# Altium schematic sheet video.SchDoc
size A4
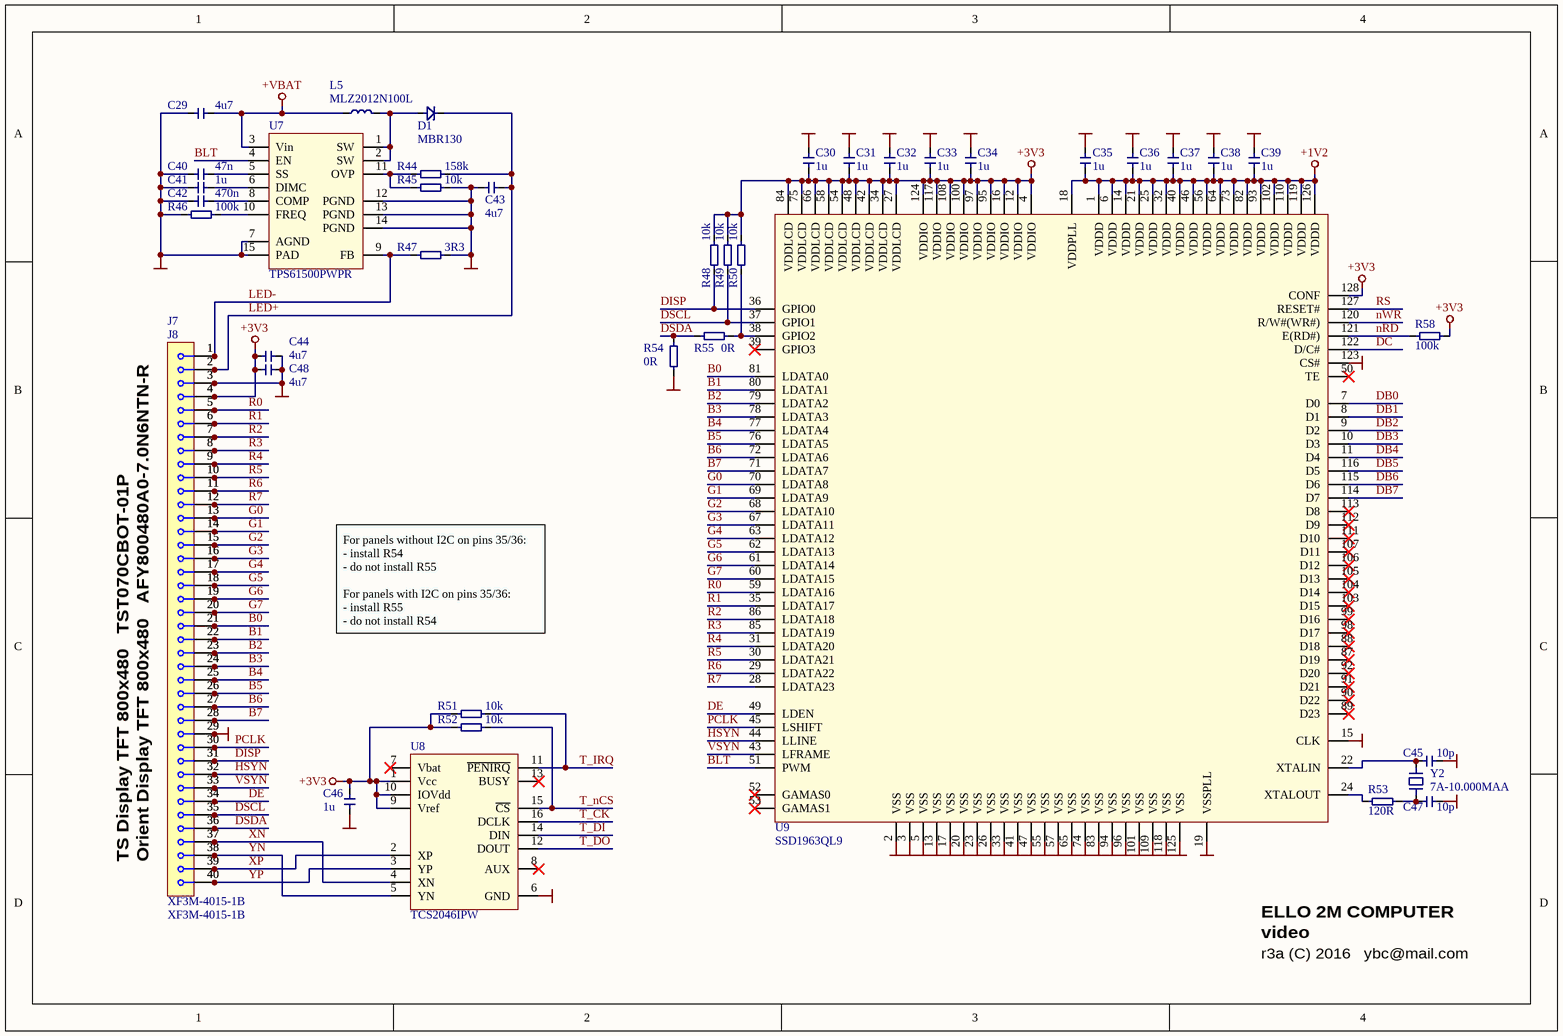
[diagram p0: video.SchDoc]

## Parts
C29  4u7  [_1206]
C30  1u  [_0603]
C31  1u  [_0603]
C32  1u  [_0603]
C33  1u  [_0603]
C34  1u  [_0603]
C35  1u  [_0603]
C36  1u  [_0603]
C37  1u  [_0603]
C38  1u  [_0603]
C39  1u  [_0603]
C40  47n  [_0603]
C41  1u  [_0603]
C42  470n  [_0603]
C43  4u7  [_1206]
C44  4u7  [_1206]
C45  10p  [_0603]
C46  1u  [_0603]
C47  10p  [_0603]
C48  4u7  [_1206]
D1  MBR130  [SOD-123]
J7  XF3M-4015-1B  [XF3M-4015-1B]
J8  XF3M-4015-1B  [XF3M-4015-1B]
L5  MLZ2012N100L  [_0805_IND]
R44  158k  [_0603]
R45  10k  [_0603]
R46  100k  [_0603]
R47  3R3  [_1206]
R48  10k  [_0603]
R49  10k  [_0603]
R50  10k  [_0603]
R51  10k  [_0603]
R52  10k  [_0603]
R53  120R  [_0603]
R54  0R  [_0603]
R55  0R  [_0603]
R58  100k  [_0603]
U7  TPS61500PWPR  [TSOP65P650X110_HS-14N]
U8  TCS2046IPW  [SOP65P640X120-16N]
U9  SSD1963QL9  [SQFP40P1600X1600-128N]
Y2  7A-10.000MAA  [Crystal 50x32 (2)]

## Nets
+1V2: C35.2 C36.2 C37.2 C38.2 C39.2 U9.1(VDDD) U9.6(VDDD) U9.14(VDDD) U9.18(VDDPLL) U9.21(VDDD) U9.25(VDDD) U9.32(VDDD) U9.40(VDDD) U9.46(VDDD) U9.56(VDDD) U9.64(VDDD) U9.73(VDDD) U9.82(VDDD) U9.93(VDDD) U9.102(VDDD) U9.110(VDDD) U9.119(VDDD) U9.126(VDDD)
+3V3: C30.2 C31.2 C32.2 C33.2 C34.2 C44.2 C46.1 C48.2 J7.4 J8.4 R48.2 R49.2 R50.2 R51.2 R52.2 R58.2 U8.1(Vcc) U8.9(Vref) U8.10(IOVdd) U9.4(VDDIO) U9.12(VDDIO) U9.16(VDDIO) U9.27(VDDLCD) U9.34(VDDLCD) U9.42(VDDLCD) U9.48(VDDLCD) U9.54(VDDLCD) U9.58(VDDLCD) U9.66(VDDLCD) U9.75(VDDLCD) U9.84(VDDLCD) U9.95(VDDIO) U9.97(VDDIO) U9.100(VDDIO) U9.108(VDDIO) U9.117(VDDIO) U9.124(VDDIO) U9.128(CONF)
+VBAT: C29.1 L5.1 U7.3(Vin)
GND: C29.2 C30.1 C31.1 C32.1 C33.1 C34.1 C35.1 C36.1 C37.1 C38.1 C39.1 C40.2 C41.2 C42.2 C43.1 C44.1 C45.2 C46.2 C47.2 C48.1 J7.3 J7.29 J8.3 J8.29 R45.2 R46.2 R47.1 R54.2 U7.7(AGND) U7.12(PGND) U7.13(PGND) U7.14(PGND) U7.15(PAD) U8.6(GND) U9.2(VSS) U9.3(VSS) U9.5(VSS) U9.13(VSS) U9.15(CLK) U9.17(VSS) U9.19(VSSPLL) U9.20(VSS) U9.23(VSS) U9.26(VSS) U9.33(VSS) U9.41(VSS) U9.47(VSS) U9.55(VSS) U9.57(VSS) U9.65(VSS) U9.74(VSS) U9.83(VSS) U9.94(VSS) U9.96(VSS) U9.101(VSS) U9.109(VSS) U9.118(VSS) U9.123(CS#) U9.125(VSS)
B0: J7.21 J8.21 U9.81(LDATA0)
B1: J7.22 J8.22 U9.80(LDATA1)
B2: J7.23 J8.23 U9.79(LDATA2)
B3: J7.24 J8.24 U9.78(LDATA3)
B4: J7.25 J8.25 U9.77(LDATA4)
B5: J7.26 J8.26 U9.76(LDATA5)
B6: J7.27 J8.27 U9.72(LDATA6)
B7: J7.28 J8.28 U9.71(LDATA7)
BLT: U7.4(EN) U9.51(PWM)
DB0: U9.7(D0)
DB1: U9.8(D1)
DB2: U9.9(D2)
DB3: U9.10(D3)
DB4: U9.11(D4)
DB5: U9.116(D5)
DB6: U9.115(D6)
DB7: U9.114(D7)
DC: U9.122(D/C#)
DE: J7.34 J8.34 U9.49(LDEN)
DISP: J7.31 J8.31 R48.1 U9.36(GPIO0)
DSCL: J7.35 J8.35 R49.1 U9.37(GPIO1)
DSDA: J7.36 J8.36 R54.1 R55.2
G0: J7.13 J8.13 U9.70(LDATA8)
G1: J7.14 J8.14 U9.69(LDATA9)
G2: J7.15 J8.15 U9.68(LDATA10)
G3: J7.16 J8.16 U9.67(LDATA11)
G4: J7.17 J8.17 U9.63(LDATA12)
G5: J7.18 J8.18 U9.62(LDATA13)
G6: J7.19 J8.19 U9.61(LDATA14)
G7: J7.20 J8.20 U9.60(LDATA15)
HSYN: J7.32 J8.32 U9.44(LLINE)
LED+: C43.2 D1.1 J7.2 J8.2 R44.2
LED-: J7.1 J8.1 R47.2 U7.9(FB)
nRD: R58.1 U9.121(E(RD#))
nWR: U9.120(R/W#(WR#))
PCLK: J7.30 J8.30 U9.45(LSHIFT)
R0: J7.5 J8.5 U9.59(LDATA16)
R1: J7.6 J8.6 U9.35(LDATA17)
R2: J7.7 J8.7 U9.86(LDATA18)
R3: J7.8 J8.8 U9.85(LDATA19)
R4: J7.9 J8.9 U9.31(LDATA20)
R5: J7.10 J8.10 U9.30(LDATA21)
R6: J7.11 J8.11 U9.29(LDATA22)
R7: J7.12 J8.12 U9.28(LDATA23)
RS: U9.127(RESET#)
T_CK: U8.16(DCLK)
T_DI: U8.14(DIN)
T_DO: U8.12(DOUT)
T_IRQ: R51.1 U8.11(~{PENIRQ})
T_nCS: R52.1 U8.15(~{CS})
VSYN: J7.33 J8.33 U9.43(LFRAME)
XN: J7.37 J8.37 U8.4(XN)
XP: J7.39 J8.39 U8.2(XP)
YN: J7.38 J8.38 U8.5(YN)
YP: J7.40 J8.40 U8.3(YP)
NetC40_1: C40.1 U7.5(SS)
NetC41_1: C41.1 U7.6(DIMC)
NetC42_1: C42.1 U7.8(COMP)
NetC45_1: C45.1 U9.22(XTALIN) Y2.2
NetC47_1: C47.1 R53.1 Y2.1
NetD1_2: D1.2 L5.2 U7.1(SW) U7.2(SW)
NetR44_1: R44.1 R45.1 U7.11(OVP)
NetR46_1: R46.1 U7.10(FREQ)
NetR50_1: R50.1 R55.1 U9.38(GPIO2)
NetR53_2: R53.2 U9.24(XTALOUT)

Not connected (* = marked no-connect by the designer): U8 7(Vbat)* 8(AUX)* 13(BUSY)*; U9 39(GPIO3)* 50(TE)* 52(GAMAS0)* 53(GAMAS1)* 87(D19)* 88(D18)* 89(D23)* 90(D22)* 91(D21)* 92(D20)* 98(D17)* 99(D16)* 103(D15)* 104(D14)* 105(D13)* 106(D12)* 107(D11)* 111(D10)* 112(D9)* 113(D8)*

## Notes on the sheet
- For panels without I2C on pins 35/36:
  - install R54
  - do not install R55
  For panels with I2C on pins 35/36:
  - install R55
  - do not install R54
- TS Display TFT 800x480   TST070CBOT-01P
- Orient Display TFT 800x480   AFY800480A0-7.0N6NTN-R
- ELLO 2M COMPUTER
- r3a (C) 2016   ybc@mail.com
- video

## Library data of the parts
C29-C48 = Capacitor
D1 = Diode Schottky: Schottky diode
J7 J8 = Connector 1x40: Single row, 40-way connector
L5 = Inductor
R44-R55 R58 = Resistor
U7 = TPS61500: TPS61500 3-A Boost Converter for High Brightness  LED Driver With Multiple Dimming Methods; Manufacturer: Texas Instruments
U8 = XPT2046 (TSOP16): Manufacturer: Shenzhen XPTEK Technology; URL: http://www.xptek.com.cn; Alternative: TCS2046
U9 = SSD1963Q: 1215KB Embedded Display SRAM LCD Display Controller; Manufacturer: Solomon Systech
Y2 = Crystal: Crystal Resonator